# EAGLE design T-Board-45-85 PCB - v0.1 (EAGLE 6.5.0)
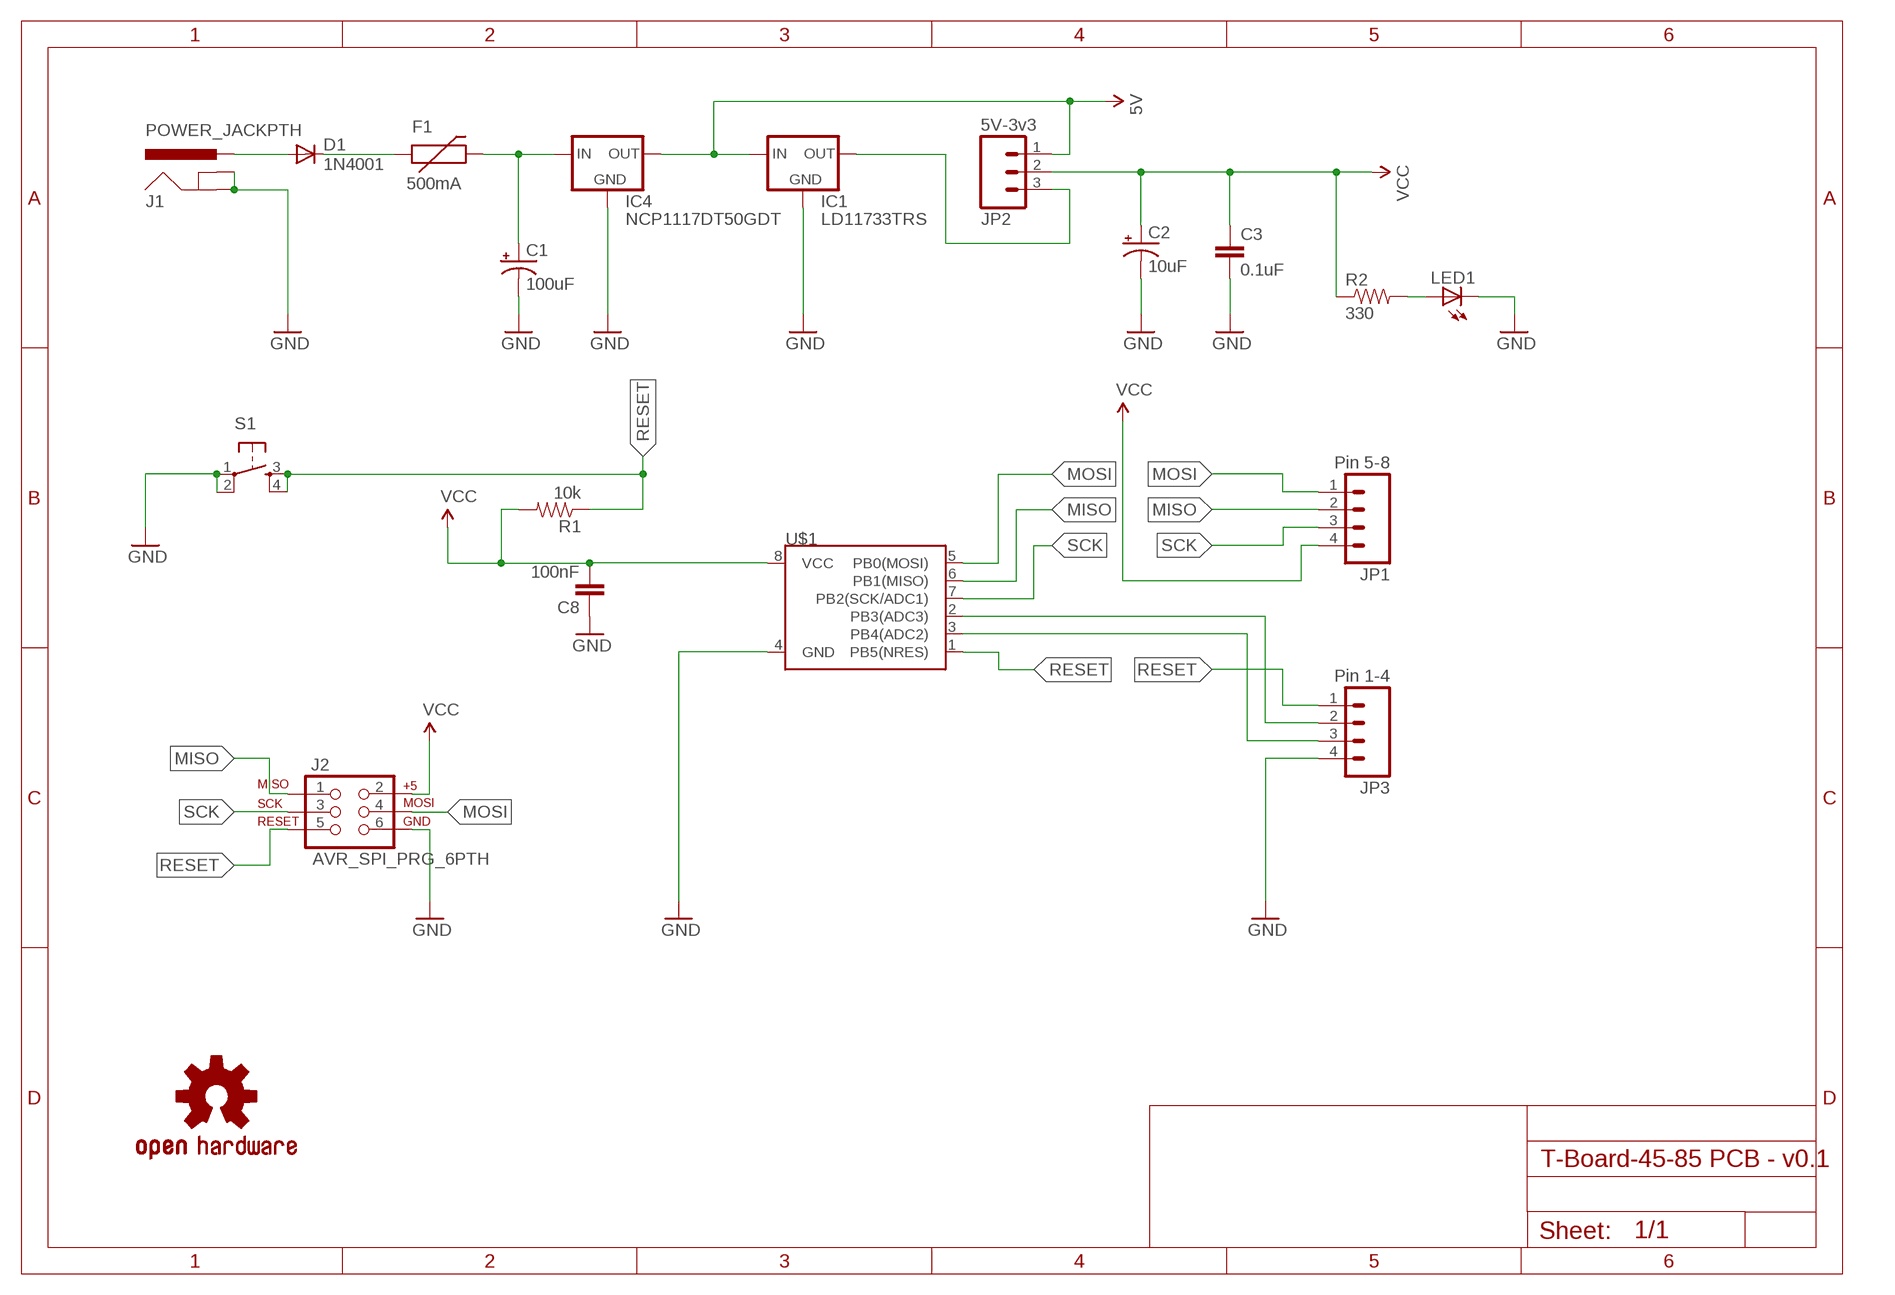
[diagram p0: schematic, sheet 1]

## Parts
C1  100uF  CAP_POLPTH1  [CPOL-RADIAL-100UF-25V]
C2  10uF  CAP_POLPTH2  [CPOL-RADIAL-10UF-25V]
C3  0.1uF  CAP1206  [1206]
C8  100nF  CAP1206  [1206]
D1  1N4001  DIODEPTH  [DIODE-1N4001]
F1  500mA  PTCPTH  [PTC]
IC1  LD11733TRS  [SOT223]
IC4  NCP1117DT50GDT  [DPACK]
J1  POWER_JACKPTH  [POWER_JACK_PTH]
J2  AVR_SPI_PRG_6PTH  [2X3]
JP1  Pin 5-8  M04-NON-POLARPTH  [1X04]
JP2  5V-3v3  M03PTH  [1X03]
JP3  Pin 1-4  M04-NON-POLARPTH  [1X04]
LED1  LED1206  [LED-1206]
LOGO1  OSHW-LOGOS  [OSHW-LOGO-S]
R1  10k  RESISTOR1206  [1206]
R2  330  RESISTOR1206  [1206]
S1  TAC_SWITCHPTH  [TACTILE-PTH]
U$1  ATTINY45TINY45-20-DIP  [DIP08]

## Nets
5V: IC1.3(IN) IC4.4(OUT) JP2.1
GND: C1.2(-) C2.2(-) C3.2 C8.1 IC1.1(GND) IC4.1(GND) J1.GND J1.GNDBREAK J2.6 JP3.4 LED1.C S1.1 S1.2 U$1.4(GND)
MISO: J2.1 JP1.2 U$1.6(PB1(MISO))
MOSI: J2.4 JP1.1 U$1.5(PB0(MOSI))
N$1: D1.A J1.PWR
N$3: D1.C F1.P$1
N$4: C1.1(+) F1.P$2 IC4.3(IN)
N$6: JP3.2 U$1.2(PB3(ADC3))
N$7: JP3.3 U$1.3(PB4(ADC2))
N$9: LED1.A R2.2
N$10: IC1.4(OUT) JP2.3
RESET: J2.5 JP3.1 R1.1 S1.3 S1.4 U$1.1(PB5(NRES))
SCK: J2.3 JP1.3 U$1.7(PB2(SCK/ADC1))
VCC: C2.1(+) C3.1 C8.2 J2.2 JP1.4 JP2.2 R1.2 R2.1 U$1.8(VCC)

## Library data of the parts
C1 C2 = SparkFun-Capacitors:CAP_POL: Capacitor Polarized These are standard SMD and PTH capacitors. Normally 10uF, 47uF, and 100uF in electrolytic and tantalum varieties. Always verify the external diameter of the through hole cap, it varies with capacity, voltage, and manufacturer. The EIA devices should be standard.
C3 C8 = SparkFun-Passives:CAP: Capacitor Standard 0603 ceramic capacitor, and 0.1" leaded capacitor.
D1 = SparkFun-DiscreteSemi:DIODE: Diode These are standard reverse protection diodes and small signal diodes. SMA package can handle up to about 1A. SOD-323 can handle about 200mA. What the SOD-323 package when ordering, there are some mfgs out there that are 5-pin packages.
F1 = SparkFun-PowerIC:PTC: Resettable Fuse PTC Resettable Fuse. Spark Fun Electronics SKU : COM-08357
IC1 = AndyTallack:LD117: Low drop fixed and adjustable positive voltage regulators 1 A Source: http://www.st.com/stonline/products/literature/ds/7194/ld1117axx.pdf
IC4 = AndyTallack:NCP1117: NCP1117 ON Semiconductor low dropout fixed voltage regulator; VOUT: 5V
J1 = SparkFun-Connectors:POWER_JACK: Power Jack This is the standard 5.5mm barrel jack for power. The PTH is the most common, proven, reliable, footprint. The Slot footprint only works if the mill layer is transmitted to the PCB fab house so be warned. Mating wall wart : TOL-00298 (and others); PROD_ID: PRT-00119
J2 = SparkFun-Connectors:AVR_SPI_PRG_6: AVR ISP 6 Pin This is the reduced ISP connector for AVR programming. Common on Arduino. This footprint will take up less PCB space and can be used with a 10-pin to 6-pin adapter such as SKU: BOB-08508
JP1 JP3 = AndyTallack:M04-NON-POLAR: Header 4 Standard 4-pin 0.1" header. Use with straight break away headers (SKU : PRT-00116), right angle break away headers (PRT-00553), swiss pins (PRT-00743), machine pins (PRT-00117), and female headers (PRT-00115). Molex polarized connector foot print use with SKU : PRT-08231 with associated crimp pins and housings. 1MM SMD Version SKU: PRT-10208
JP2 = SparkFun-Connectors:M03: Header 3 Standard 3-pin 0.1" header. Use with straight break away headers (SKU : PRT-00116), right angle break away headers (PRT-00553), swiss pins (PRT-00743), machine pins (PRT-00117), and female headers (PRT-00115). Molex polarized connector foot print use with SKU : PRT-08232 with associated crimp pins and housings.
LED1 = SparkFun-LED:LED: LEDs Standard schematic elements and footprints for 5mm, 3mm, 1206, and 0603 sized LEDs. 5mm - Spark Fun Electronics SKU : COM-00529 (and others)
LOGO1 = SparkFun-Aesthetics:OSHW-LOGO: Open Source Hardware Logo This logo indicates the piece of hardware it is found on incorporates a OSHW license and/or adheres to the definition of open source hardware found here: http://freedomdefined.org/OSHW
R1 R2 = SparkFun-Passives:RESISTOR: Resistor Basic schematic elements and footprints for 0603, 1206, and PTH resistors.
S1 = SparkFun-Electromechanical:TAC_SWITCH: Momentary Switch Button commonly used for reset or general input. Spark Fun Electronics SKU : COM-00097 SMT- SWCH-08247
U$1 = SparkFun-DigitalIC:ATTINY45: Atmel 8-pin 2/4/8kB flash uC; PROD_ID: IC-09439; VALUE: TINY45-20-DIP

## Net classes
0 default: width 0.254 mm, drill 0.33 mm, clearance 0.254 mm

## Board
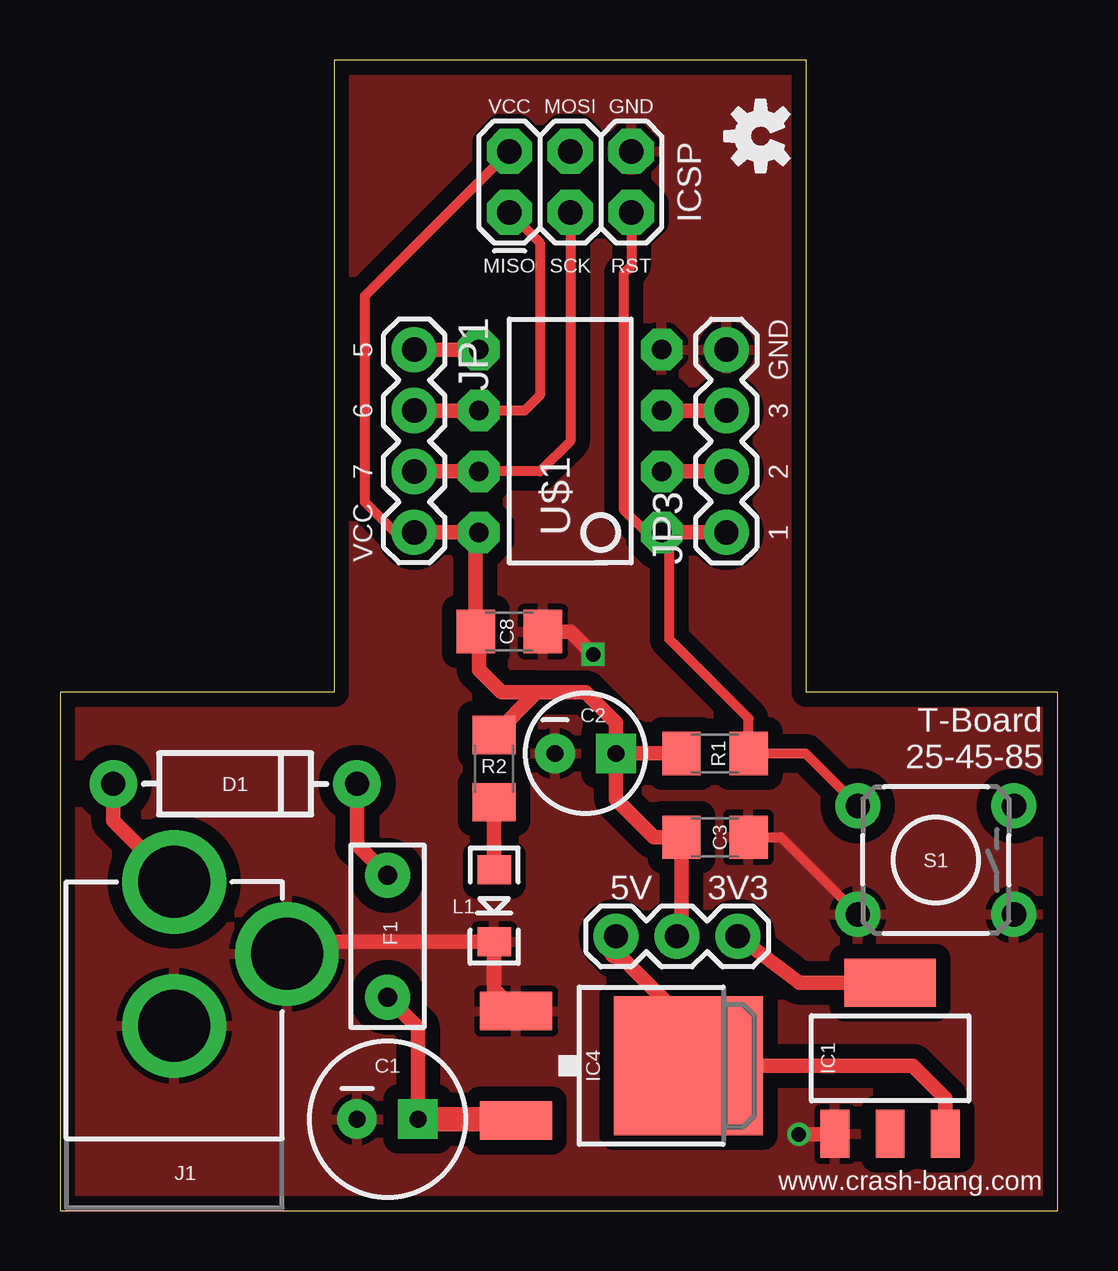
[diagram p1: board, top side]
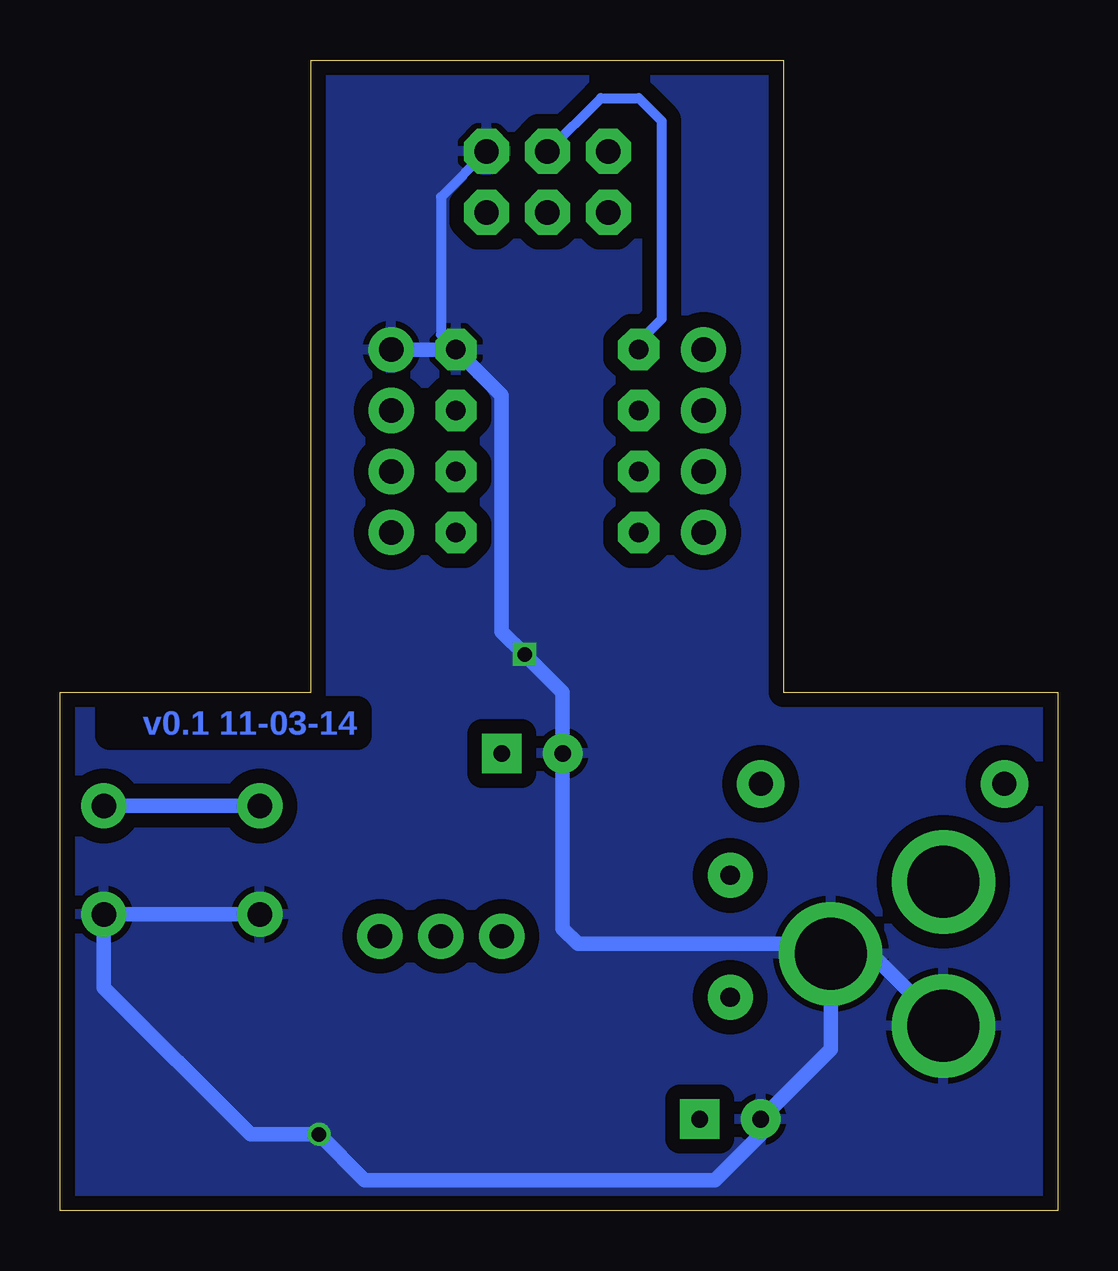
[diagram p2: board, bottom side, seen from below]

Size 41.59 x 47.94 mm. Coordinates in mm from the lower left corner, seen from the top.
Outline: 0,0 41.59,0 41.59,21.59 31.12,21.59 31.12,47.94 11.43,47.94 11.43,21.59 0,21.59 0,0
Copper layers (1*16): Top 0.0356mm / dielectric 1.5011mm / Bottom 0.0356mm
Design rules "T-Board-328 v0.3g": minimum track width 6mil, minimum drill 13mil, track to track 0.205mm, track to pad 0.205mm, pad to pad 0.205mm, via to via 0.205mm, smd to smd 6mil, copper to edge 15mil, drill to drill 6mil, minimum pad ring 7mil, minimum via ring 7mil, stop-mask expansion 3mil, vias tented up to drill 0mil, thermal gap 10mil

### Footprints (pad centres in the part's own frame; a part is rotated, then mirrored left to right if it is on the bottom)
CPOL-RADIAL-100UF-25V = drill 0.7 pad 1.651 square: 1 1.27,0 | drill 0.7 pad 1.651: 2 -1.27,0
CPOL-RADIAL-10UF-25V = drill 0.7 pad 1.651 square: 1 1.27,0 | drill 0.7 pad 1.651: 2 -1.27,0
1206 = smd 1.6 x 1.8: 1 -1.4,0; 2 1.4,0
DIODE-1N4001 = drill 1 pad 1.981: A -5.08,0; C 5.08,0
PTC = drill 0.8 pad 1.88: P$1 -2.54,0; P$2 2.54,0
SOT223 = smd 1.2 x 2: 1 -2.3,-3.15; 2 0,-3.15; 3 2.3,-3.15 | smd 3.8 x 2: 4 0,3.15
DPACK = smd 1.6 x 3: 1 -2.28,-4.8; 3 2.28,-4.8 | smd 5.8 x 6.2: 4 0,2.38
POWER_JACK_PTH = drill 2.997 pad 4.318: GND 0,7.7; GNDBREAK 4.7,10.7; PWR 0,13.7
2X3 = drill 1.016 pad 1.88 octagon: 1 0,0; 2 0,2.54; 3 2.54,0; 4 2.54,2.54; 5 5.08,0; 6 5.08,2.54
1X04 = drill 1.016 pad 1.88: 1 0,0; 2 2.54,0; 3 5.08,0; 4 7.62,0
1X03 = drill 1.016 pad 1.88: 1 0,0; 2 2.54,0; 3 5.08,0
LED-1206 = smd 1.2 x 1.4: A -1.5,0; C 1.5,0
TACTILE-PTH = drill 1.016 pad 1.88: 1 -3.251,2.261; 2 3.251,2.261; 3 -3.251,-2.261; 4 3.251,-2.261
DIP08 = drill 0.813 pad 1.727 octagon: 1 -3.81,-3.81; 2 -1.27,-3.81; 3 1.27,-3.81; 4 3.81,-3.81; 5 3.81,3.81; 6 1.27,3.81; 7 -1.27,3.81; 8 -3.81,3.81

### Placement (x,y rotation side)
C1  13.65,3.81 0 top
C2  21.91,19.05 0 top
C3  27.3,15.56 0 top
C8  18.73,24.13 180 top
D1  7.3,17.78 0 top
F1  13.65,11.43 270 top
IC1  34.61,6.35 0 top
IC4  23.81,6.03 270 top
J1  4.76,0 0 top
J2  18.73,41.59 0 top
JP1  14.76,35.88 270 top
JP2  23.18,11.43 0 top
JP3  27.78,28.26 90 top
LED1  18.1,12.7 270 top
LOGO1  29.21,44.77 90 top
R1  27.3,19.05 180 top
R2  18.1,18.41 270 top
S1  36.51,14.61 180 top
U$1  21.27,32.07 90 top

### Tracks (layer width: path | path; a pad name or v marks a point on that pad's centre or on a via)
5V
  Top 0.61: IC4.4 35.56,6.03 36.91,4.68 IC1.3 | 23.18,10.79 25.72,8.26
  Top 1.016: JP2.1 23.18,10.79 | 25.72,8.26 25.72,6.51 IC4.4
GND  (via drill 0.6)
  Top 0.406: C3.2 30.05,15.56 S1.2
  Top 0.61: IC1.1 32.28,3.17 v30.8,3.17 | IC4.1 18.1,9.23 LED1.C 9.96,11.2 J1.GNDBREAK | v22.22,23.18 21.27,24.13 C8.1
  Bottom 0.406: U$1.4 25.72,36.51 25.72,42.23 J2.6
  Bottom 0.61: J1.GNDBREAK 7.76,10.7 J1.GND | J1.GNDBREAK 9.46,6.73 C1.2 12.38,3.17 14.29,1.27 28.89,1.27 v30.8,3.17 33.66,3.17 39.76,9.28 S1.1 S1.2 | J1.GNDBREAK 9.88,11.11 20,11.11 20.64,11.75 C2.2 20.64,21.59 v22.22,23.18 23.18,24.13 23.18,33.97 U$1.4 JP3.4
  pour Bottom (isolate 0.61): 11.43,47.94 31.12,47.94 31.12,21.59 41.59,21.59 41.59,0 0,0 0,21.59 11.43,21.59
  pour Top (isolate 0.61): 11.43,47.94 31.12,47.94 31.12,21.59 41.59,21.59 41.59,0 0,0 0,21.59 11.43,21.59
MISO
  Top 0.406: U$1.6 19.37,33.34 20,33.97 20,40.32 J2.1
  Top 0.61: JP1.2 U$1.6
MOSI
  Top 0.61: JP1.1 U$1.5
  Bottom 0.406: J2.4 19.05,46.35 17.46,46.35 16.51,45.4 16.51,37.15 17.46,36.2 U$1.5
N$1
  Top 0.61: J1.PWR 2.22,16.24 D1.A
N$3
  Top 0.61: D1.C 12.38,15.24 F1.P$1
N$4
  Top 0.61: F1.P$2 14.92,7.62 C1.1
  Top 1.016: C1.1 19.01,3.81 IC4.3
N$6
  Top 0.61: U$1.2 JP3.2
N$7
  Top 0.61: U$1.3 JP3.3
N$9
  Top 0.61: R2.2 LED1.A
N$10
  Top 0.61: JP2.3 30.82,9.5 IC1.4
RESET
  Top 0.406: S1.4 31.08,19.05 R1.1 28.7,20.51 25.4,23.81 25.4,27.94 U$1.1 24.45,28.26 23.49,29.21 23.49,39.05 23.81,39.37 J2.5
  Top 0.61: U$1.1 JP3.1
  Bottom 0.61: S1.4 S1.3
SCK
  Top 0.406: U$1.7 20,30.8 21.27,32.07 J2.3
  Top 0.61: JP1.3 U$1.7
VCC
  Top 0.406: J2.2 12.7,38.1 12.7,29.53 13.97,28.26 JP1.4
  Top 0.61: 25.9,11.62 C3.1 24.77,15.56 23.18,17.14 C2.1 | R2.1 19.87,21.59 | 19.87,21.59 21.91,21.59 23.18,20.32 C2.1 | C2.1 R1.2 | JP1.4 U$1.8 17.33,28.13 C8.2 17.46,24 17.46,22.54 18.41,21.59 19.87,21.59
  Top 1.016: JP2.2 25.9,11.62 | 26.04,15.69 C3.1

### Text on the board
Bottom: v0.1 11-03-14
tNames: VCC | MOSI | GND | ICSP | MISO | SCK | RST | 5 | GND | 6 | 3 | 7 | 2 | VCC | 1 | T-Board / 25-45-85 | S1 | 5V | 3V3 | L1 | www.crash-bang.com